# Altium schematic sheet CPU.3.SchDoc
size C
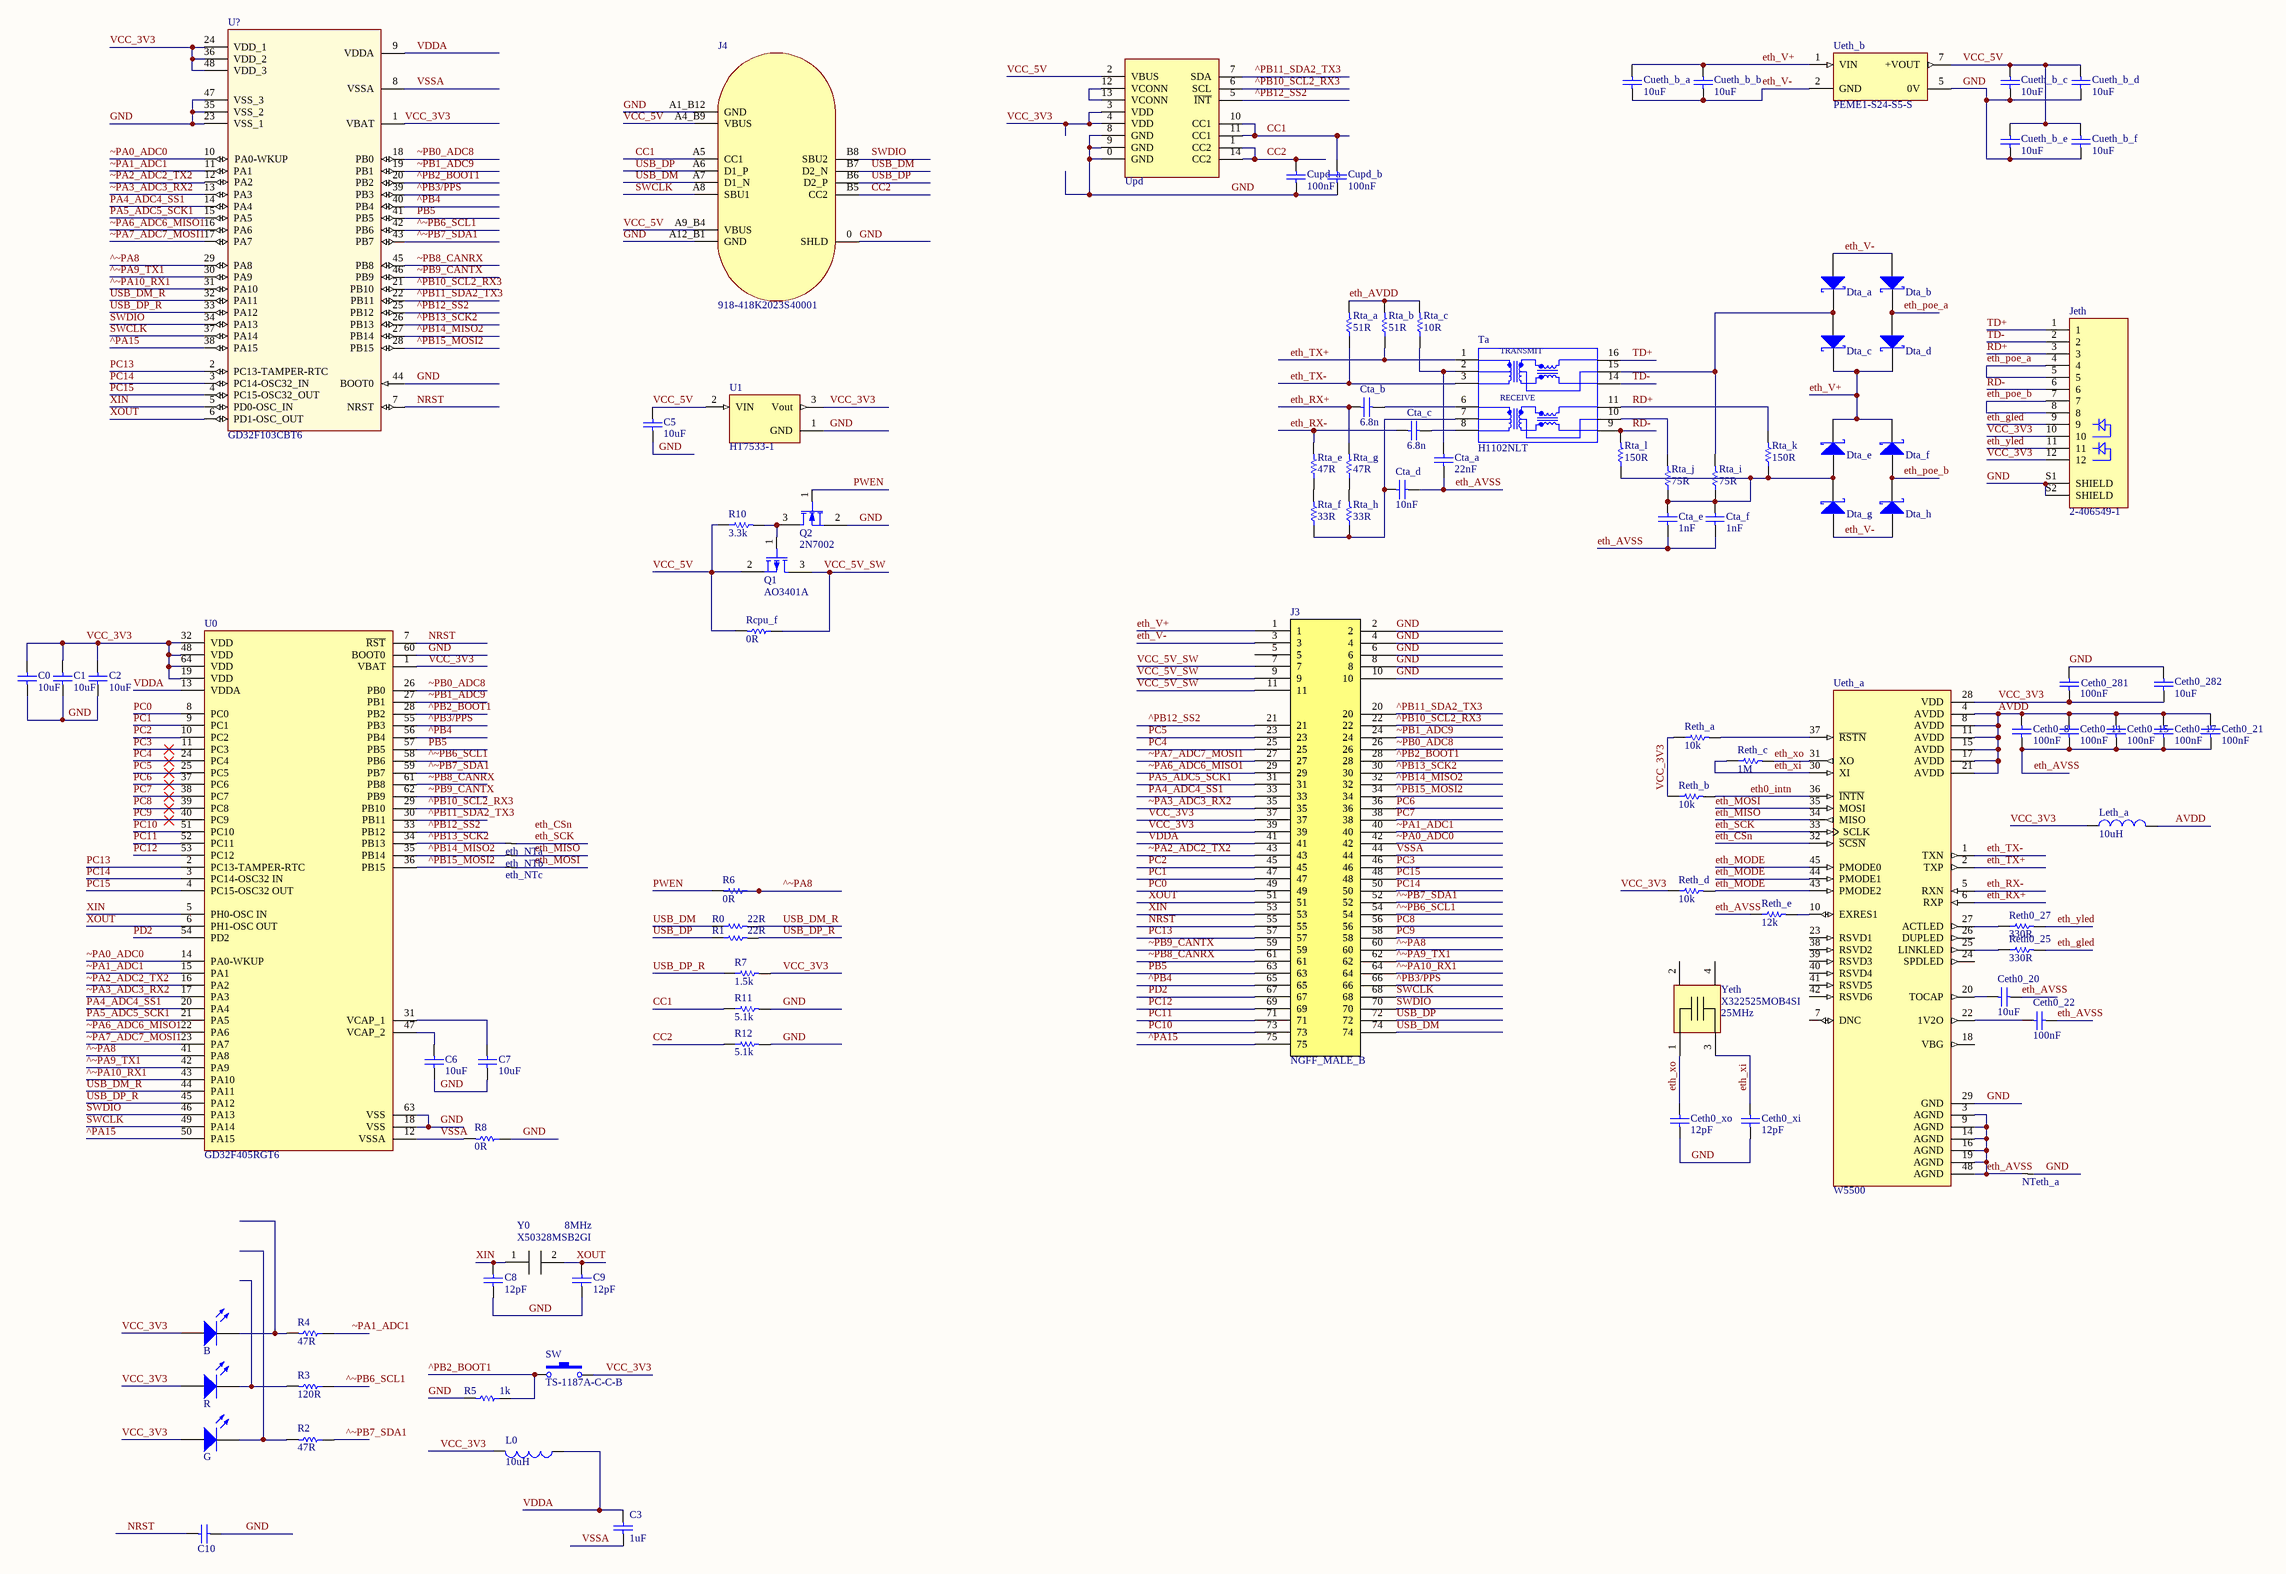
[diagram p0: CPU.3.SchDoc]

## Parts
B  19-217/BHC-ZL1M2RY/3T  [D_0603]  (value not drawn)
C0  value 10uF  [C_0402]  (hidden comment: CL05A106MQ5NUNC)
C1  value 10uF  [C_0402]  (hidden comment: CL05A106MQ5NUNC)
C2  value 10uF  [C_0402]  (hidden comment: CL05A106MQ5NUNC)
C3  value 1uF  [C_0402]  (hidden comment: CL05A105KA5NQNC)
C5  value 10uF  [C_0805]  (hidden comment: CL21A106KAYNNNE)
C6  value 10uF  [C_0402]  (hidden comment: CL05A106MQ5NUNC)
C7  value 10uF  [C_0402]  (hidden comment: CL05A106MQ5NUNC)
C8  value 12pF  [C_0402]  (hidden comment: 0402CG120J500NT)
C9  value 12pF  [C_0402]  (hidden comment: 0402CG120J500NT)
C10  0402CG101J500NT  [C_0402]  (value not drawn)
Ceth0_8  value 100nF  [C_0402]  (hidden comment: CL05B104KO5NNNC)
Ceth0_11  value 100nF  [C_0402]  (hidden comment: CL05B104KO5NNNC)
Ceth0_15  value 100nF  [C_0402]  (hidden comment: CL05B104KO5NNNC)
Ceth0_17  value 100nF  [C_0402]  (hidden comment: CL05B104KO5NNNC)
Ceth0_20  value 10uF  [C_0402]  (hidden comment: CL05A106MQ5NUNC)
Ceth0_21  value 100nF  [C_0402]  (hidden comment: CL05B104KO5NNNC)
Ceth0_22  value 100nF  [C_0402]  (hidden comment: CL05B104KO5NNNC)
Ceth0_281  value 100nF  [C_0402]  (hidden comment: CL05B104KO5NNNC)
Ceth0_282  value 10uF  [C_0402]  (hidden comment: CL05A106MQ5NUNC)
Ceth0_xi  value 12pF  [C_0402]  (hidden comment: 0402CG120J500NT)
Ceth0_xo  value 12pF  [C_0402]  (hidden comment: 0402CG120J500NT)
Cta_a  value 22nF  [C_0402]  (hidden comment: 0402B223K500NT)
Cta_b  value 6.8n  [C_0402]  (hidden comment: 0402B682K500NT)
Cta_c  value 6.8n  [C_0402]  (hidden comment: 0402B682K500NT)
Cta_d  value 10nF  [C_0402]  (hidden comment: CL05B103KB5NNNC)
Cta_e  value 1nF  [C_1206]  (hidden comment: 1206B102K202NT)
Cta_f  value 1nF  [C_1206]  (hidden comment: 1206B102K202NT)
Cueth_b_a  value 10uF  [C_0805]  (hidden comment: CL21A106KAYNNNE)
Cueth_b_b  value 10uF  [C_0805]  (hidden comment: CL21A106KAYNNNE)
Cueth_b_c  value 10uF  [C_0402]  (hidden comment: CL05A106MQ5NUNC)
Cueth_b_d  value 10uF  [C_0402]  (hidden comment: CL05A106MQ5NUNC)
Cueth_b_e  value 10uF  [C_0402]  (hidden comment: CL05A106MQ5NUNC)
Cueth_b_f  value 10uF  [C_0402]  (hidden comment: CL05A106MQ5NUNC)
Cupd_a  value 100nF  [C_0402]  (hidden comment: CL05B104KO5NNNC)
Cupd_b  value 100nF  [C_0402]  (hidden comment: CL05B104KO5NNNC)
Dta_a  1N5819WS  [SOD-323]  (value not drawn)
Dta_b  1N5819WS  [SOD-323]  (value not drawn)
Dta_c  1N5819WS  [SOD-323]  (value not drawn)
Dta_d  1N5819WS  [SOD-323]  (value not drawn)
Dta_e  1N5819WS  [SOD-323]  (value not drawn)
Dta_f  1N5819WS  [SOD-323]  (value not drawn)
Dta_g  1N5819WS  [SOD-323]  (value not drawn)
Dta_h  1N5819WS  [SOD-323]  (value not drawn)
eth_NTa  0  [NET_TIE]  (value not drawn)
eth_NTb  0  [NET_TIE]  (value not drawn)
eth_NTc  0  [NET_TIE]  (value not drawn)
G  19-217/GHC-YR1S2/3T  [D_0603]  (value not drawn)
J3  NGFF_MALE_B  [NGFF_MALE_B]
J4  918-418K2023S40001  [DX07S016JA1R1500]
Jeth  2-406549-1  [TE_2-406549-1]
L0  value 10uH  [L_0603]  (hidden comment: SDFL1608S100KTF)
Leth_a  value 10uH  [L_0603]  (hidden comment: SDFL1608S100KTF)
NTeth_a  0  [NET_TIE]  (value not drawn)
Q1  AO3401A  [TO-236AB]
Q2  2N7002  [TO-236AB]
R  KT-0603R  [D_0603]  (value not drawn)
R0  value 22R  [R_0402]  (hidden comment: 0402WGF220JTCE)
R1  value 22R  [R_0402]  (hidden comment: 0402WGF220JTCE)
R2  value 47R  [R_0402]  (hidden comment: 0402WGF470JTCE)
R3  value 120R  [R_0402]  (hidden comment: 0402WGF1200TCE)
R4  value 47R  [R_0402]  (hidden comment: 0402WGF470JTCE)
R5  value 1k  [R_0402]  (hidden comment: 0402WGF1001TCE)
R6  value 0R  [R_0402]  (hidden comment: 0402WGF0000TCE)
R7  value 1.5k  [R_0402]  (hidden comment: 0402WGF1501TCE)
R8  value 0R  [R_0402]  (hidden comment: 0402WGF0000TCE)
R10  value 3.3k  [R_0402]  (hidden comment: 0402WGF3301TCE)
R11  value 5.1k  [R_0402]  (hidden comment: 0402WGF5101TCE)
R12  value 5.1k  [R_0402]  (hidden comment: 0402WGF5101TCE)
Rcpu_f  value 0R  [R_0402]  (hidden comment: 0402WGF0000TCE)
Reth0_25  value 330R  [R_0402]  (hidden comment: 0402WGF3300TCE)
Reth0_27  value 330R  [R_0402]  (hidden comment: 0402WGF3300TCE)
Reth_a  value 10k  [R_0402]  (hidden comment: 0402WGF1002TCE)
Reth_b  value 10k  [R_0402]  (hidden comment: 0402WGF1002TCE)
Reth_c  value 1M  [R_0402]  (hidden comment: 0402WGF1004TCE)
Reth_d  value 10k  [R_0402]  (hidden comment: 0402WGF1002TCE)
Reth_e  value 12k  [R_0402]  (hidden comment: 0402WGF1202TCE)
Rta_a  value 51R  [R_0402]  (hidden comment: 0402WGF5100TCE)
Rta_b  value 51R  [R_0402]  (hidden comment: 0402WGF5100TCE)
Rta_c  value 10R  [R_0402]  (hidden comment: 0402WGF100JTCE)
Rta_e  value 47R  [R_0402]  (hidden comment: 0402WGF470JTCE)
Rta_f  value 33R  [R_0402]  (hidden comment: 0402WGF330JTCE)
Rta_g  value 47R  [R_0402]  (hidden comment: 0402WGF470JTCE)
Rta_h  value 33R  [R_0402]  (hidden comment: 0402WGF330JTCE)
Rta_i  value 75R  [R_0402]  (hidden comment: 0402WGF750JTCE)
Rta_j  value 75R  [R_0402]  (hidden comment: 0402WGF750JTCE)
Rta_k  value 150R  [R_0402]  (hidden comment: 0402WGF1500TCE)
Rta_l  value 150R  [R_0402]  (hidden comment: 0402WGF1500TCE)
SW  TS-1187A-C-C-B  [TS-1187A-C-C-B]
Ta  H1102NLT  [XFMR_H1102NLT]
U0  GD32F405RGT6  [QFP-64-P0.5MM]
U1  HT7533-1  [SOT-223-3]
U?  GD32F103CBT6  [QFP-48-P0.5MM]
Ueth_a  W5500  [QFP-48-P0.5MM]
Ueth_b  PEME1-S24-S5-S  [CONV_PEME1-S5-S3-S]
Upd  FUSB302BMPX  [QFN-14-P0.5MM]  (value not drawn)
Y0  X50328MSB2GI  value 8MHz  [YSX530GA]
Yeth  X322525MOB4SI  value 25MHz  [X322512MSB4SI]

## Nets
^PA15: J3.75 U0.50(PA15) U?.38(PA15)
^PB2_BOOT1: J3.28 R5.1 SW.1 U0.28(PB2) U?.20(PB2)
^PB3/PPS: J3.66 U0.55(PB3) U?.39(PB3)
^PB4: J3.65 U0.56(PB4) U?.40(PB4)
^PB10_SCL2_RX3: J3.22 U0.29(PB10) U?.21(PB10) Upd.6(SCL)
^PB11_SDA2_TX3: J3.20 U0.30(PB11) U?.22(PB11) Upd.7(SDA)
^PB12_SS2: J3.21 U0.33(PB12) U?.25(PB12) Upd.5(~{INT})
^PB13_SCK2: eth_NTa.1 J3.30 U0.34(PB13) U?.26(PB13)
^PB14_MISO2: eth_NTb.1 J3.32 U0.35(PB14) U?.27(PB14)
^PB15_MOSI2: eth_NTc.1 J3.34 U0.36(PB15) U?.28(PB15)
^~PA8: J3.60 R6.2 U0.41(PA8) U?.29(PA8)
^~PA9_TX1: J3.62 U0.42(PA9) U?.30(PA9)
^~PA10_RX1: J3.64 U0.43(PA10) U?.31(PA10)
^~PB6_SCL1: J3.54 R3.1 U0.58(PB6) U?.42(PB6)
^~PB7_SDA1: J3.52 R2.1 U0.59(PB7) U?.43(PB7)
AVDD: Ceth0_8.2 Ceth0_11.2 Ceth0_15.2 Ceth0_17.2 Ceth0_21.2 Leth_a.2 Ueth_a.4(AVDD) Ueth_a.8(AVDD) Ueth_a.11(AVDD) Ueth_a.15(AVDD) Ueth_a.17(AVDD) Ueth_a.21(AVDD)
CC1: Cupd_b.1 J4.A5(CC1) R11.1 Upd.10(CC1) Upd.11(CC1)
CC2: Cupd_a.1 J4.B5(CC2) R12.1 Upd.1(CC2) Upd.14(CC2)
eth0_intn: Reth_b.2 Ueth_a.36(~{INTN})
eth_AVDD: Rta_a.2 Rta_b.2 Rta_c.2
eth_AVSS: Ceth0_8.1 Ceth0_11.1 Ceth0_15.1 Ceth0_17.1 Ceth0_20.2 Ceth0_21.1 Ceth0_22.1 Cta_a.1 Cta_d.2 Cta_e.1 Cta_f.1 NTeth_a.1 Reth_e.1 Ueth_a.3(AGND) Ueth_a.9(AGND) Ueth_a.14(AGND) Ueth_a.16(AGND) Ueth_a.19(AGND) Ueth_a.48(AGND)
eth_CSn: Ueth_a.32(~{SCSN})
eth_gled: Jeth.9 Reth0_25.2
eth_MISO: eth_NTb.2 Ueth_a.34(MISO)
eth_MODE: Reth_d.2 Ueth_a.43(PMODE2) Ueth_a.44(PMODE1) Ueth_a.45(PMODE0)
eth_MOSI: eth_NTc.2 Ueth_a.35(MOSI)
eth_poe_a: Dta_b.1(K) Dta_d.2(A) Jeth.4 Jeth.5
eth_poe_b: Dta_f.2(A) Dta_h.1(K) Jeth.7 Jeth.8
eth_RX+: Cta_b.1 Rta_g.2 Ueth_a.6(RXP)
eth_RX-: Cta_c.1 Rta_e.2 Ueth_a.5(RXN)
eth_SCK: eth_NTa.2 Ueth_a.33(SCLK)
eth_TX+: Rta_b.1 Ta.1 Ueth_a.2(TXP)
eth_TX-: Rta_a.1 Ta.3 Ueth_a.1(TXN)
eth_V+: Cueth_b_a.2 Cueth_b_b.2 Dta_c.1(K) Dta_d.1(K) Dta_e.1(K) Dta_f.1(K) J3.1 Ueth_b.1(VIN)
eth_V-: Cueth_b_a.1 Cueth_b_b.1 Dta_a.2(A) Dta_b.2(A) Dta_g.2(A) Dta_h.2(A) J3.3 Ueth_b.2(GND)
eth_xi: Ceth0_xi.2 Reth_c.1 Ueth_a.30(XI) Yeth.3
eth_xo: Ceth0_xo.2 Reth_c.2 Ueth_a.31(XO) Yeth.1
eth_yled: Jeth.11 Reth0_27.2
GND: C0.1 C1.1 C2.1 C5.1 C6.1 C7.1 C8.1 C9.1 C10.1 Ceth0_281.1 Ceth0_282.2 Ceth0_xi.1 Ceth0_xo.1 Cueth_b_c.1 Cueth_b_d.1 Cueth_b_e.1 Cueth_b_f.1 Cupd_a.2 Cupd_b.2 J3.2 J3.4 J3.6 J3.8 J3.10 J4.0(SHLD) J4.A1_B12(GND) J4.A12_B1(GND) Jeth.S1(SHIELD) Jeth.S2(SHIELD) NTeth_a.2 Q2.2(S) R5.2 R8.1 R11.2 R12.2 U0.18(VSS) U0.60(BOOT0) U0.63(VSS) U1.1(GND) U?.23(VSS_1) U?.35(VSS_2) U?.44(BOOT0) U?.47(VSS_3) Ueth_a.29(GND) Ueth_b.5(0V) Upd.0(GND) Upd.8(GND) Upd.9(GND)
NRST: C10.2 J3.55 U0.7(~{RST}) U?.7(NRST)
PA4_ADC4_SS1: J3.33 U0.20(PA4) U?.14(PA4)
PA5_ADC5_SCK1: J3.31 U0.21(PA5) U?.15(PA5)
PB5: J3.63 U0.57(PB5) U?.41(PB5)
PC0: J3.49 U0.8(PC0)
PC1: J3.47 U0.9(PC1)
PC2: J3.45 U0.10(PC2)
PC3: J3.46 U0.11(PC3)
PC4: J3.25 U0.24(PC4)
PC5: J3.23 U0.25(PC5)
PC6: J3.36 U0.37(PC6)
PC7: J3.38 U0.38(PC7)
PC8: J3.56 U0.39(PC8)
PC9: J3.58 U0.40(PC9)
PC10: J3.73 U0.51(PC10)
PC11: J3.71 U0.52(PC11)
PC12: J3.69 U0.53(PC12)
PC13: J3.57 U0.2(PC13-TAMPER-RTC) U?.2(PC13-TAMPER-RTC)
PC14: J3.50 U0.3(PC14-OSC32_IN) U?.3(PC14-OSC32_IN)
PC15: J3.48 U0.4(PC15-OSC32_OUT) U?.4(PC15-OSC32_OUT)
PD2: J3.67 U0.54(PD2)
PWEN: Q2.1(G) R6.1
RD+: Jeth.3 Rta_k.2 Ta.11
RD-: Jeth.6 Rta_l.2 Ta.9
SWCLK: J3.68 J4.A8(SBU1) U0.49(PA14) U?.37(PA14)
SWDIO: J3.70 J4.B8(SBU2) U0.46(PA13) U?.34(PA13)
TD+: Jeth.1 Ta.16
TD-: Jeth.2 Ta.14
USB_DM: J3.74 J4.A7(D1_N) J4.B7(D2_N) R0.1
USB_DM_R: R0.2 U0.44(PA11) U?.32(PA11)
USB_DP: J3.72 J4.A6(D1_P) J4.B6(D2_P) R1.1
USB_DP_R: R1.2 R7.1 U0.45(PA12) U?.33(PA12)
VCC_3V3: B.2(A) C0.2 C1.2 C2.2 Ceth0_281.2 Ceth0_282.1 G.2(A) J3.37 J3.39 Jeth.10 Jeth.12 L0.2 Leth_a.1 R.2(A) R7.2 Reth_a.1 Reth_b.1 Reth_d.1 SW.2 U0.1(VBAT) U0.19(VDD) U0.32(VDD) U0.48(VDD) U0.64(VDD) U1.3(Vout) U?.1(VBAT) U?.24(VDD_1) U?.36(VDD_2) U?.48(VDD_3) Ueth_a.28(VDD) Upd.3(VDD) Upd.4(VDD)
VCC_5V: C5.2 Cueth_b_c.2 Cueth_b_d.2 Cueth_b_e.2 Cueth_b_f.2 J4.A4_B9(VBUS) J4.A9_B4(VBUS) Q1.2(S) R10.1 Rcpu_f.2 U1.2(VIN) Ueth_b.7(+VOUT) Upd.2(VBUS)
VCC_5V_SW: J3.7 J3.9 J3.11 Q1.3(D) Rcpu_f.1
VDDA: C3.2 J3.41 L0.1 U0.13(VDDA) U?.9(VDDA)
VSSA: C3.1 J3.44 R8.2 U0.12(VSSA) U?.8(VSSA)
XIN: C8.2 J3.53 U0.5(PH0-OSC_IN) U?.5(PD0-OSC_IN) Y0.1
XOUT: C9.2 J3.51 U0.6(PH1-OSC_OUT) U?.6(PD1-OSC_OUT) Y0.2
~PA0_ADC0: J3.42 U0.14(PA0-WKUP) U?.10(PA0-WKUP)
~PA1_ADC1: J3.40 R4.1 U0.15(PA1) U?.11(PA1)
~PA2_ADC2_TX2: J3.43 U0.16(PA2) U?.12(PA2)
~PA3_ADC3_RX2: J3.35 U0.17(PA3) U?.13(PA3)
~PA6_ADC6_MISO1: J3.29 U0.22(PA6) U?.16(PA6)
~PA7_ADC7_MOSI1: J3.27 U0.23(PA7) U?.17(PA7)
~PB0_ADC8: J3.26 U0.26(PB0) U?.18(PB0)
~PB1_ADC9: J3.24 U0.27(PB1) U?.19(PB1)
~PB8_CANRX: J3.61 U0.61(PB8) U?.45(PB8)
~PB9_CANTX: J3.59 U0.62(PB9) U?.46(PB9)
NetB_1: B.1(K) R4.2
NetC6_2: C6.2 U0.47(VCAP_2)
NetC7_2: C7.2 U0.31(VCAP_1)
NetCeth0_20_1: Ceth0_20.1 Ueth_a.20(TOCAP)
NetCeth0_22_2: Ceth0_22.2 Ueth_a.22(1V2O)
NetCta_a_2: Cta_a.2 Rta_c.1 Ta.2
NetCta_b_2: Cta_b.2 Ta.6
NetCta_c_2: Cta_c.2 Ta.8
NetCta_d_1: Cta_d.1 Rta_f.1 Rta_h.1 Ta.7
NetCta_e_2: Cta_e.2 Cta_f.2 Dta_e.2(A) Dta_g.1(K) Rta_i.1 Rta_j.1 Rta_k.1 Rta_l.1
NetDta_a_1: Dta_a.1(K) Dta_c.2(A) Rta_i.2 Ta.15
NetG_1: G.1(K) R2.2
NetQ1_1: Q1.1(G) Q2.3(D) R10.2
NetR_1: R.1(K) R3.2
NetReth0_25_1: Reth0_25.1 Ueth_a.25(LINKLED)
NetReth0_27_1: Reth0_27.1 Ueth_a.27(ACTLED)
NetReth_a_2: Reth_a.2 Ueth_a.37(~{RSTN})
NetReth_e_2: Reth_e.2 Ueth_a.10(EXRES1)
NetRta_e_1: Rta_e.1 Rta_f.2
NetRta_g_1: Rta_g.1 Rta_h.2
NetRta_j_2: Rta_j.2 Ta.10
NetUpd_12: Upd.12(VCONN) Upd.13(VCONN)

Not connected (* = marked no-connect by the designer): J3 5; Ueth_a 7(DNC) 18(VBG) 23(RSVD1) 24(SPDLED) 26(DUPLED) 38(RSVD2) 39(RSVD3) 40(RSVD4) 41(RSVD5) 42(RSVD6); Yeth 2(GND) 4(GND)

## Notes on the sheet
- Labels drawn without touching a wire or pin: eth_CSn
- (in symbol H1102NLT) TRANSMIT; RECEIVE

## Library data of the parts
B = 19-217/BHC-ZL1M2RY/3T: D - LED - 0603 - Blue; LCSC Part #: C72041; JLC Availability: Basic
C0-C2 C6 C7 Ceth0_20 Ceth0_282 Cueth_b_c Cueth_b_d Cueth_b_e Cueth_b_f = CL05A106MQ5NUNC: C - CAPACITOR - MLCC - 10uF - 6.3V - 0402; WVDC: 6.3; LCSC Part #: C15525; JLC Availability: Basic
C3 = CL05A105KA5NQNC: C - CAPACITOR - MLCC - 1uF - 25V - 0402; WVDC: 16; LCSC Part #: C52923; JLC Availability: Basic
C5 Cueth_b_a Cueth_b_b = CL21A106KAYNNNE: C - CAPACITOR - MLCC - 10uF - 25V - 0805; WVDC: 25; LCSC Part #: C15850; Availability: Basic
C8 C9 Ceth0_xi Ceth0_xo = 0402CG120J500NT: C - CAPACITOR - MLCC - 12pF - 50V - 0402; WVDC: 50; LCSC Part #: C1547; JLC Availability: Basic
C10 = 0402CG101J500NT: C - CAPACITOR - MLCC - 100pF - 50V - 0402; LCSC Part #: C1546; JLC Availability: Extended
Ceth0_8 Ceth0_11 Ceth0_15 Ceth0_17 Ceth0_21 Ceth0_22 Ceth0_281 Cupd_a Cupd_b = CL05B104KO5NNNC: C - CAPACITOR - MLCC - 100nF - 16V - 0402; WVDC: 16; LCSC Part #: C1525; JLC Availability: Basic
Cta_a = 0402B223K500NT: C - CAPACITOR - MLCC - 22nF - 50V - 0402; WVDC: 50; LCSC Part #: C1532; JLC Availability: Basic
Cta_b Cta_c = 0402B682K500NT: C - CAPACITOR - MLCC - 6.8nF - 50V - 0402; WVDC: 50; LCSC Part #: C1542; JLC Availability: Basic
Cta_d = CL05B103KB5NNNC: C - CAPACITOR - MLCC - 10nF - 50V - 0402; WVDC: 50; LCSC Part #: C15195; JLC Availability: Basic
Cta_e Cta_f = 1206B102K202NT: C - CAPACITOR - MLCC - 1nF - 2000V - 1206 - X7R; WVDC: 2000; LCSC Part #: C9196; JLC Availability: Basic
Dta_a Dta_b Dta_c Dta_d Dta_e Dta_f Dta_g Dta_h = 1N5819WS: D - DIODE - SCHOTTKY - 40V - 1A; Trr: 4ns; LCSC Part #: C191023; JLC Availability: Basic; PIV: 40V; If: 1A
eth_NTa eth_NTb eth_NTc NTeth_a = NET_TIE: R - Net Tie
G = 19-217/GHC-YR1S2/3T: D - LED - 0603 - Green; LCSC Part #: C72043; JLC Availability: Basic
J3 = NGFF_MALE_B: NGFF Male Finger, B Key; Manufacturer: Kyocera; Manufacturer P/N: 245863050024829
J4 = 918-418K2023S40001: J - JACK - USB - Type C - Recepticle - SMT - 90°; JLC Availability: LCSC; LCSC Part #: C167321
Jeth = 2-406549-1: J - JACK - ETHERNET - Right - THT; LCSC Part #: C125068; JLC Availability: Extended
L0 Leth_a = SDFL1608S100KTF: L - INDUCTOR - 10uH - 0603; LCSC Part #: C1035; JLC Availability: Basic
Q1 = AO3401A: Q - TRANSISTOR - MOSFET (P) - 30V - 1.4A - 0.44 Ohm; WVDC: 30; JLC Availability: Basic; LCSC Part #: C15127
Q2 = 2N7002: Q - TRANSISTOR - MOSFET (N) - 60V - 200mW; WVDC: 60; JLC Availability: Basic; LCSC Part #: C8545
R = KT-0603R: D - LED - 0603 - Red; LCSC Part #: C2286; JLC Availability: Basic
R0 R1 = 0402WGF220JTCE: R - RESISTOR - SMD - 22R - 1% - 0402; LCSC Part #: C25092; JLC Availability: Basic
R2 R4 Rta_e Rta_g = 0402WGF470JTCE: R - RESISTOR - SMD - 47R - 1% - 0402; LCSC Part #: C25118; JLC Availability: Basic
R3 = 0402WGF1200TCE: R - RESISTOR - SMD - 120R - 1% - 0402; LCSC Part #: C25079; JLC Availability: Basic
R5 = 0402WGF1001TCE: R - RESISTOR - SMD - 1k - 1% - 0402; LCSC Part #: C11702; JLC Availability: Basic
R6 R8 Rcpu_f = 0402WGF0000TCE: R - RESISTOR - SMD - 0R - 1% - 0402; LCSC Part #: C17168; JLC Availability: Basic
R7 = 0402WGF1501TCE: R - RESISTOR - SMD - 1.5k - 1% - 0402; LCSC Part #: C25867; JLC Availability: Basic
R10 = 0402WGF3301TCE: R - RESISTOR - SMD - 3.3k - 1% - 0402; LCSC Part #: C25890; JLC Availability: Basic
R11 R12 = 0402WGF5101TCE: R - RESISTOR - SMD - 5.1k - 1% - 0402; LCSC Part #: C25905; JLC Availability: Basic
Reth0_25 Reth0_27 = 0402WGF3300TCE: R - RESISTOR - SMD - 330R - 1% - 0402; LCSC Part #: C25104; JLC Availability: Basic
Reth_a Reth_b Reth_d = 0402WGF1002TCE: R - RESISTOR - SMD - 10k - 1% - 0402; LCSC Part #: C25744; JLC Availability: Basic
Reth_c = 0402WGF1004TCE: R - RESISTOR - SMD - 1M - 1% - 0402; LCSC Part #: C26083; JLC Availability: Basic
Reth_e = 0402WGF1202TCE: R - RESISTOR - SMD - 12k - 1% - 0402; LCSC Part #: C25752; JLC Availability: Basic
Rta_a Rta_b = 0402WGF5100TCE: R - RESISTOR - SMD - 51R - 1% - 0402; LCSC Part #: C25123; JLC Availability: Basic
Rta_c = 0402WGF100JTCE: R - RESISTOR - SMD - 10R - 1% - 0402; LCSC Part #: C25077; JLC Availability: Basic
Rta_f Rta_h = 0402WGF330JTCE: R - RESISTOR - SMD - 33R - 1% - 0402; LCSC Part #: C25105; JLC Availability: Basic
Rta_i Rta_j = 0402WGF750JTCE: R - RESISTOR - SMD - 75R - 1% - 0402; LCSC Part #: C25133; JLC Availability: Basic
Rta_k Rta_l = 0402WGF1500TCE: R - RESISTOR - SMD - 150R - 1% - 0402; LCSC Part #: C25082; JLC Availability: Basic
SW = TS-1187A-C-C-B: SW - SWITCH - SPST - NO - Top Actuated Surface Mount; LCSC Part #: C318889; JLC Availability: Extended
Ta = H1102NLT: T - Transfrormer - Isolation and Data Interface _Encapsulated_ Pulse Transformer 1:1 Transmitter, 1:1 Receiver Surface Mount; MF: Pulse Electronics; Package: SOIC-16 Pulse; Value: *; LCSC Part #: C18584; MP: H1102NL; SnapEDA_Link: https://www.snapeda.com/parts/H1102NL/Pulse%20Electronics%20Network/view-part/78695/?ref=snap; Availability: Extended
U0 = GD32F405RGT6: U - IC - MCU 32BIT 1MB FLASH 64LQFP; ComponentLink2Description: Datasheet; ComponentLink1URL: https://upverter.com/upn/revision/179c87d5c3d4f257/; ComponentLink1Description: Upverter; ComponentLink2URL: http://www.st.com/content/ccc/resource/technical/document/datasheet/33/d4/6f/1d/df/0b/4c/6d/CD00161566.pdf/files/CD00161566.pdf/jcr:content/translations/en.CD00161566.pdf; LCSC Part #: C99031; JLC Availability: Extended
U1 = HT7533-1: U - IC - 3V3 Power Regulator; VOut: 3.3; LCSC Part #: C14289; JLC Availability: Basic
U? = GD32F103CBT6: U - IC - MCU, 128 KB Flash, 20 KB Internal RAM, 37 I/Os, 48-pin LQFP, -40 to 85 degC; FLASH Size (Prog) (kB): 128; I/Os (High Current): 37; Internal RAM Size (kB): 20; Operating Frequency(F) (Processor speed) (MHz): 72; ComponentLink1Description: Manufacturer URL; ComponentLink1URL: http://www.st.com/web/en/home.html; ComponentLink2Description: Datasheet; ComponentLink2URL: http://www.st.com/st-web-ui/static/active/en/resource/technical/document/datasheet/CD00161566.pdf; ComponentLink3Description: Package Specification; ComponentLink3URL: http://www.st.com/st-web-ui/static/active/en/resource/technical/document/datasheet/DM00058181.pdf; LCSC Part #: C77979; JLC Availability: Extended
Ueth_a = W5500: U - IC - Ethernet Controller 10/100 Base-T/TX PHY SPI Interface 48-LQFP (7x7); MF: WIZnet; Value: *; Package: None; LCSC Part #: C32843; Price: None; MP: W5500; Availability: Extended; SnapEDA_Link: https://www.snapeda.com/parts/W5500/WIZnet/view-part/?ref=snap; Purchase-URL: https://pricing.snapeda.com/search/part/W5500/?ref=eda
Ueth_b = PEME1-S24-S5-S: U - IC - 1 W, 1:1 Input Range, Single/Dual Unregulated Output, SIP, 24VDC IN, 3000 Vdc Isolation, Dc-Dc Converter; Value: 5VDC; MF: CUI Inc.; Package: SIP; Purchase-URL: https://pricing.snapeda.com/search/part/PEME1-S5-S3-S/?ref=eda; MP: PEME1-S24-S5-S; LCSC Part #: N/A; Availability: None; SnapEDA_Link: https://www.snapeda.com/parts/PEME1-S5-S3-S/CUI/view-part/?ref=snap; CUI_purchase_URL: https://www.cui.com/product/dc-dc-converters/isolated/peme1-s-series?utm_source=snapeda.com&utm_medium=referral&utm_campaign=snapedaBOM
Upd = FUSB302BMPX: U - IC - USB PD PHY; JLC Availability: Extended; LCSC Part #: C442699
Y0 = X50328MSB2GI: Y - RESONATOR - 8MHZ ±10PPM - SMD-5032; Availability: Basic; LCSC Part #: C115962
Yeth = X322525MOB4SI: Y - RESONATOR - 25MHZ ±10PPM; LCSC Part #: C9006; JLC Availability: Basic